# Altium schematic sheet Sheet2.SchDoc
size B
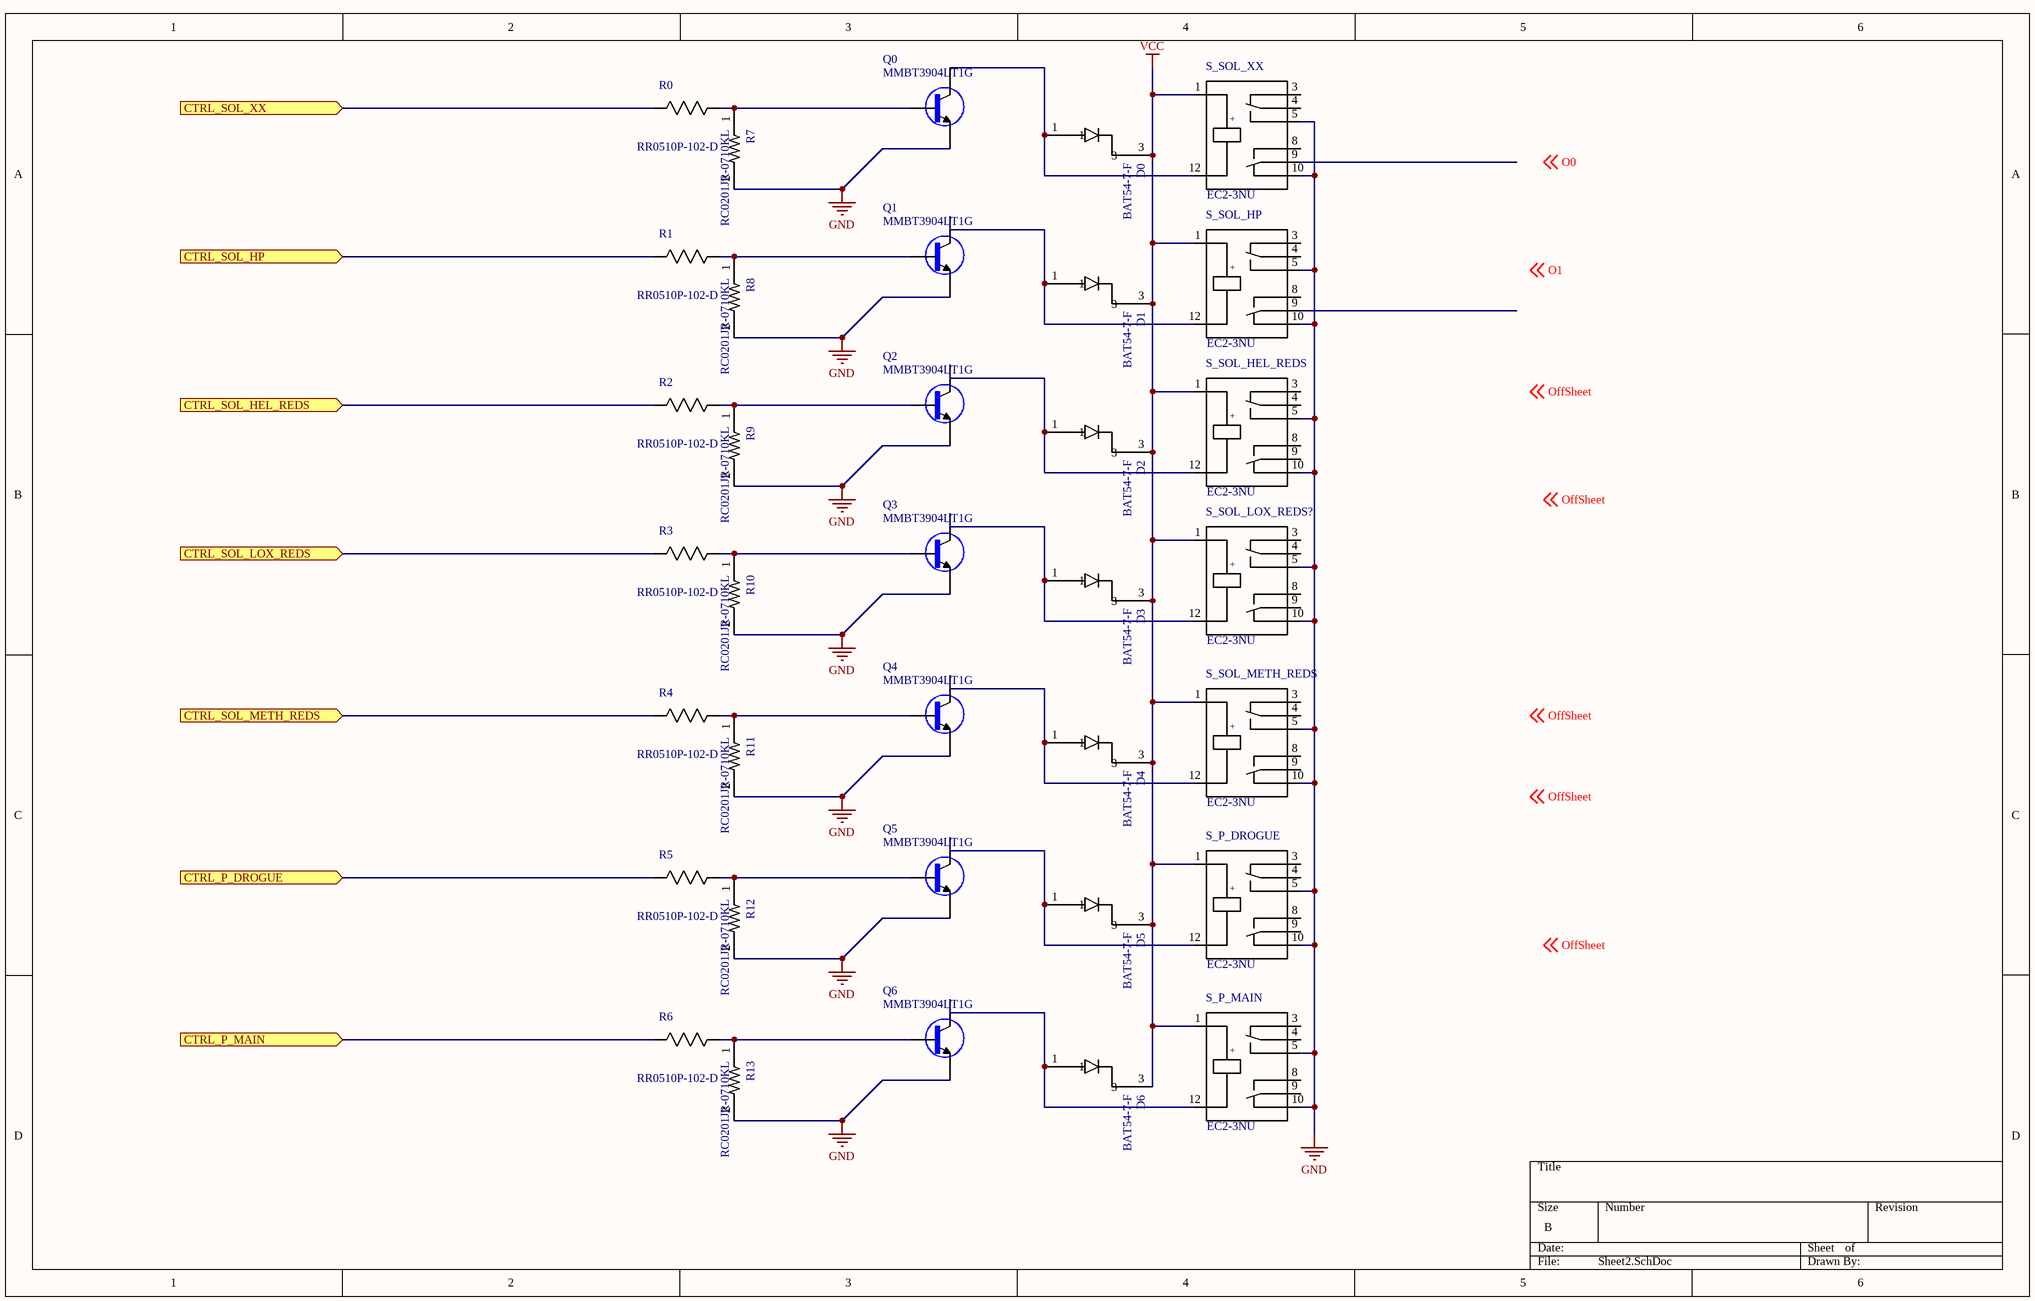
[diagram p0: Sheet2.SchDoc]

## Parts
D0  BAT54-7-F  [*SOT95P240X110-3N]
D1  BAT54-7-F  [*SOT95P240X110-3N]
D2  BAT54-7-F  [*SOT95P240X110-3N]
D3  BAT54-7-F  [*SOT95P240X110-3N]
D4  BAT54-7-F  [*SOT95P240X110-3N]
D5  BAT54-7-F  [*SOT95P240X110-3N]
D6  BAT54-7-F  [*SOT95P240X110-3N]
Q0  MMBT3904LT1G  [*SOT23]
Q1  MMBT3904LT1G  [*SOT23]
Q2  MMBT3904LT1G  [*SOT23]
Q3  MMBT3904LT1G  [*SOT23]
Q4  MMBT3904LT1G  [*SOT23]
Q5  MMBT3904LT1G  [*SOT23]
Q6  MMBT3904LT1G  [*SOT23]
R0  RR0510P-102-D  [*RESC1005X40N]
R1  RR0510P-102-D  [*RESC1005X40N]
R2  RR0510P-102-D  [*RESC1005X40N]
R3  RR0510P-102-D  [*RESC1005X40N]
R4  RR0510P-102-D  [*RESC1005X40N]
R5  RR0510P-102-D  [*RESC1005X40N]
R6  RR0510P-102-D  [*RESC1005X40N]
R7  RC0201JR-0710KL  [*RESC0603X26N]
R8  RC0201JR-0710KL  [*RESC0603X26N]
R9  RC0201JR-0710KL  [*RESC0603X26N]
R10  RC0201JR-0710KL  [*RESC0603X26N]
R11  RC0201JR-0710KL  [*RESC0603X26N]
R12  RC0201JR-0710KL  [*RESC0603X26N]
R13  RC0201JR-0710KL  [*RESC0603X26N]
S_P_DROGUE  EC2-3NU  [*KEMET_EC2-3NU]
S_P_MAIN  EC2-3NU  [*KEMET_EC2-3NU]
S_SOL_HEL_REDS  EC2-3NU  [*KEMET_EC2-3NU]
S_SOL_HP  EC2-3NU  [*KEMET_EC2-3NU]
S_SOL_LOX_REDS?  EC2-3NU  [*KEMET_EC2-3NU]
S_SOL_METH_REDS  EC2-3NU  [*KEMET_EC2-3NU]
S_SOL_XX  EC2-3NU  [*KEMET_EC2-3NU]

## Ports
CTRL_P_DROGUE (in), CTRL_P_MAIN (in), CTRL_SOL_HEL_REDS (in), CTRL_SOL_HP (in), CTRL_SOL_LOX_REDS (in), CTRL_SOL_METH_REDS (in), CTRL_SOL_XX (in)

## Nets
GND: Q0.2(E) Q1.2(E) Q2.2(E) Q3.2(E) Q4.2(E) Q5.2(E) Q6.2(E) R7.2 R8.2 R9.2 R10.2 R11.2 R12.2 R13.2 S_P_DROGUE.5 S_P_DROGUE.10 S_P_MAIN.5 S_P_MAIN.10 S_SOL_HEL_REDS.5 S_SOL_HEL_REDS.10 S_SOL_HP.5 S_SOL_HP.10 S_SOL_LOX_REDS?.5 S_SOL_LOX_REDS?.10 S_SOL_METH_REDS.5 S_SOL_METH_REDS.10 S_SOL_XX.5 S_SOL_XX.10
VCC: D0.3 D1.3 D2.3 D3.3 D4.3 D5.3 D6.3 S_P_DROGUE.1 S_P_MAIN.1 S_SOL_HEL_REDS.1 S_SOL_HP.1 S_SOL_LOX_REDS?.1 S_SOL_METH_REDS.1 S_SOL_XX.1
CTRL_P_DROGUE: R5.2(R2) ; port CTRL_P_DROGUE
CTRL_P_MAIN: R6.2(R2) ; port CTRL_P_MAIN
CTRL_SOL_HEL_REDS: R2.2(R2) ; port CTRL_SOL_HEL_REDS
CTRL_SOL_HP: R1.2(R2) ; port CTRL_SOL_HP
CTRL_SOL_LOX_REDS: R3.2(R2) ; port CTRL_SOL_LOX_REDS
CTRL_SOL_METH_REDS: R4.2(R2) ; port CTRL_SOL_METH_REDS
CTRL_SOL_XX: R0.2(R2) ; port CTRL_SOL_XX
NetD0_1: D0.1 Q0.3(C) S_SOL_XX.12
NetD1_1: D1.1 Q1.3(C) S_SOL_HP.12
NetD2_1: D2.1 Q2.3(C) S_SOL_HEL_REDS.12
NetD3_1: D3.1 Q3.3(C) S_SOL_LOX_REDS?.12
NetD4_1: D4.1 Q4.3(C) S_SOL_METH_REDS.12
NetD5_1: D5.1 Q5.3(C) S_P_DROGUE.12
NetD6_1: D6.1 Q6.3(C) S_P_MAIN.12
NetQ0_1: Q0.1(B) R0.1(R1) R7.1
NetQ1_1: Q1.1(B) R1.1(R1) R8.1
NetQ2_1: Q2.1(B) R2.1(R1) R9.1
NetQ3_1: Q3.1(B) R3.1(R1) R10.1
NetQ4_1: Q4.1(B) R4.1(R1) R11.1
NetQ5_1: Q5.1(B) R5.1(R1) R12.1
NetQ6_1: Q6.1(B) R6.1(R1) R13.1

Not connected (* = marked no-connect by the designer): S_P_DROGUE 3 4 8 9; S_P_MAIN 3 4 8 9; S_SOL_HEL_REDS 3 4 8 9; S_SOL_HP 3 4 8 9; S_SOL_LOX_REDS? 3 4 8 9; S_SOL_METH_REDS 3 4 8 9; S_SOL_XX 3 4 8 9

## Notes on the sheet
- Labels drawn without touching a wire or pin: O0, O1, OffSheet
- (in symbol EC2-3NU) +

## Library data of the parts
D0-D6 = BAT54-7-F: Diode, Ultrafast Recovery, 200Ma, 30V, Sot-23-3, Full Reel; MF: Multicomp; SnapEDA_Link: https://www.snapeda.com/parts/BAT54-7-F/Multicomp/view-part/?ref=snap; Availability: Unavailable; Price: None; MP: BAT54-7-F; Package: SOT-23-3 Multicomp; Value: *
Q0-Q6 = MMBT3904LT1G: MF: ON Semiconductor; Price: None; SnapEDA_Link: https://www.snapeda.com/parts/MMBT3904LT1G/ON%20Semiconductor/view-part/?ref=snap; Availability: Unavailable; MP: MMBT3904LT1G; Package: SOT-23-3 NXP Semiconductors; Value: *
R0-R6 = RR0510P-102-D: Res Thin Film 0402 1K Ohm 0.5% 0.063W_1/16W_ ?25ppm/C Molded SMD Automotive T/R; MF: Susumu; SnapEDA_Link: https://www.snapeda.com/parts/RR0510P-102-D/Susumu/view-part/?ref=snap; Availability: Unavailable; Price: None; MP: RR0510P-102-D; Package: 0402 Susumu; Value: *
R7-R13 = RC0201JR-0710KL: / RC Series 0201 0.05 W 10 kOhms 5% Â±200 ppm/Â°C SMT Thick Film Chip Resistor /; MF: Yageo; Price: None; SnapEDA_Link: https://www.snapeda.com/parts/RC0201JR-0710KL/Yageo/view-part/?ref=snap; Availability: Unavailable; MP: RC0201JR-0710KL; Package: 0201 Yageo; Value: *
S_P_DROGUE S_P_MAIN S_SOL_HEL_REDS S_SOL_HP S_SOL_LOX_REDS? S_SOL_METH_REDS S_SOL_XX = EC2-3NU: MF: KEMET; Package: None; Price: None; SnapEDA_Link: https://www.snapeda.com/parts/EC2-3NU/KEMET/view-part/?ref=snap; MP: EC2-3NU; Availability: Unavailable; Value: *